# Altium schematic sheet TopLevel.SchDoc (part 2 of 3)
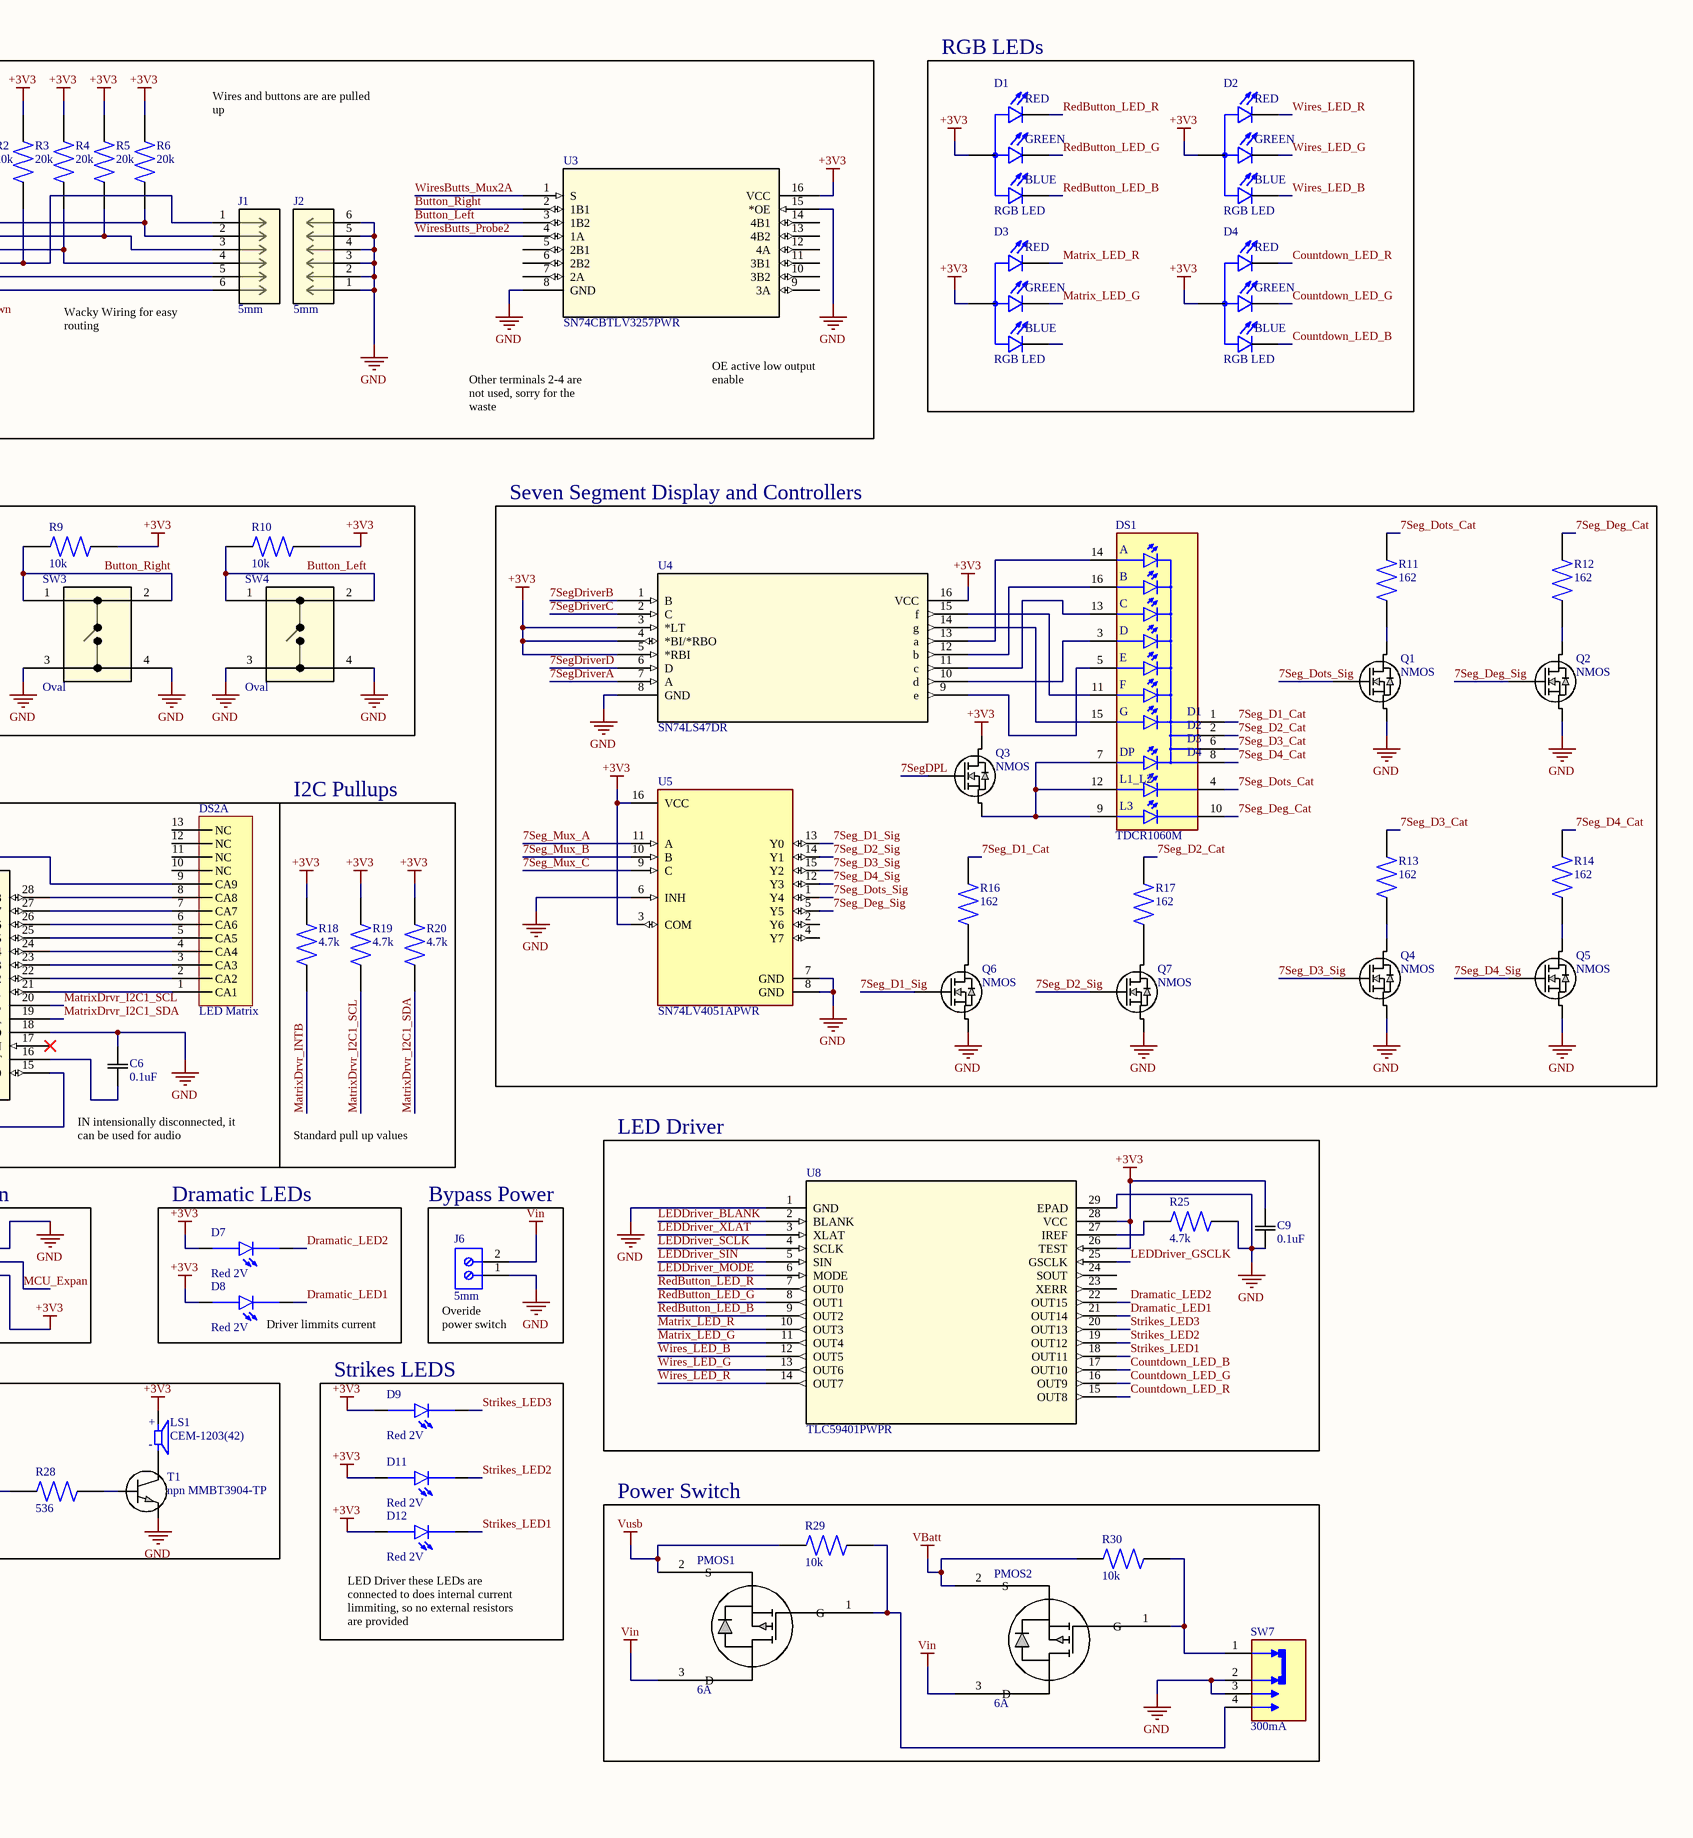
[diagram p2: TopLevel.SchDoc, right]
## Library data of the parts
C1 C3 C6 C9-C12 C15 = CAP CER 0.1uF 50V 0805: Ceramic Capacitor, Multilayer, Ceramic, 50V, 10% +Tol, 10% -Tol, X7R, 15% TC, 0.1uF, Surface Mount, 0805; Manufacturer: Yageo; Manufacturer Part Number: CC0805KRX7R9BB104; Value: 100nF; Multilayer: Yes; Supplier: Digikey; Supplier Part Number: 311-1140-1-ND; RoHS: Yes; Category: Ceramic Capacitors; Stock: 2043650; Pricing: 1=0.08, 10=0.027, 100=0.0192, 1000=0.0136 (USD); Mounting Technology: Surface Mount; Pins: 2; Dielectric Material: Ceramic; Package Shape: Rectangular; Case/Package: 0805; Terminal Finish: Nickel; Min Operating Temperature: -55°C; Max Operating Temperature: 125°C; JESD-609 Code: e3; Capacitor Type: Ceramic; Tolerance  (fill in as +-): 10%; Package Style: SMTMeter; Packaging: Tape and Reel; Tolerance (fill in as +-): 10%; Rated DC Voltage (URdc): 50V; Temperature Characteristics Code: X7R; Termination: Wraparound; Length: 2mm; Width: 1.25mm; Height: 0.85mm; Reach SVHC Compliant: Yes; RoHS Compliant: Yes; ComponentLink1URL: https://datasheet.ciiva.com:443/pdfs/VipMasterIC/IC/YAGO/YAGO-S-A0003557223/YAGO-S-A0003557223-1.pdf?src-supplier=IHS+Markit; ComponentLink1Description: https://datasheet.ciiva.com:443/pdfs/VipMasterIC/IC/YAGO/YAGO-S-A0003557223/YAGO-S-A0003557223-1.pdf?src-supplier=IHS+Markit; ComponentLink2URL: https://datasheet.ciiva.com/11786/0900766b80d84f1d-11786009.pdf?src-supplier=Rs; ComponentLink2Description: https://datasheet.ciiva.com/11786/0900766b80d84f1d-11786009.pdf?src-supplier=Rs; ComponentLink3URL: https://datasheet.ciiva.com/11464/upy-gphc-x7r-6-3v-to-50v-8-11464757.pdf?src-supplier=Avnet; ComponentLink3Description: https://datasheet.ciiva.com/11464/upy-gphc-x7r-6-3v-to-50v-8-11464757.pdf?src-supplier=Avnet; ComponentLink4URL: https://datasheet.ciiva.com/155/mlccorderingcode-155930.pdf?src-supplier=Digikey; ComponentLink4Description: https://datasheet.ciiva.com/155/mlccorderingcode-155930.pdf?src-supplier=Digikey; ComponentLink5URL: https://datasheet.ciiva.com/28450/1489800-28450805.pdf?src-supplier=Element14; ComponentLink5Description: https://datasheet.ciiva.com/28450/1489800-28450805.pdf?src-supplier=Element14; ComponentLink6URL: https://datasheet.ciiva.com/46393/1734573-46393307.pdf?src-supplier=Element14; ComponentLink6Description: https://datasheet.ciiva.com/46393/1734573-46393307.pdf?src-supplier=Element14; ComponentLink7URL: https://datasheet.ciiva.com/155/mlccorderingcode-155929.pdf?src-supplier=Digikey; ComponentLink7Description: https://datasheet.ciiva.com/155/mlccorderingcode-155929.pdf?src-supplier=Digikey; ComponentLink8URL: https://datasheet.ciiva.com/155/mlccorderingcode-155931.pdf?src-supplier=Digikey; ComponentLink8Description: https://datasheet.ciiva.com/155/mlccorderingcode-155931.pdf?src-supplier=Digikey; ComponentLink9URL: https://datasheet.ciiva.com/29242/445210-da-01-en-kerko-chip-0805-x7r-0-1uf-10proz-50vg-29242074.pdf?src-supplier=Conrad; ComponentLink9Description: https://datasheet.ciiva.com/29242/445210-da-01-en-kerko-chip-0805-x7r-0-1uf-10proz-50vg-29242074.pdf?src-supplier=Conrad
C2 C7 C14 = CAP CER 1uF 50V 0805: Ceramic Capacitor, Multilayer, Ceramic, 50V, 10% +Tol, 10% -Tol, X7R, 15% TC, 1uF, Surface Mount, 0805; Manufacturer: Samsung; Manufacturer Part Number: CL21B105KBFNNNE; Multilayer: Yes; Supplier: Digikey; Supplier Part Number: 1276-1029-1-ND; RoHS: Yes; Category: Ceramic Capacitors; Stock: 365183; Pricing: 1=0.08, 10=0.024, 100=0.016, 1000=0.01299 (USD); Mounting Technology: Surface Mount; Pins: 2; Dielectric Material: Ceramic; Package Shape: Rectangular; Case/Package: 0805; Terminal Finish: Nickel; Min Operating Temperature: -55°C; Max Operating Temperature: 125°C; JESD-609 Code: e3; Value: 1uF; Capacitor Type: Ceramic; Tolerance  (fill in as +-): 10%; Package Style: SMTMeter; Packaging: Tape and Reel; Tolerance (fill in as +-): 10%; Rated DC Voltage (URdc): 50V; Temperature Characteristics Code: X7R; Termination: Wraparound; Length: 2mm; Width: 1.25mm; Height: 1.35mm; Reach SVHC Compliant: Yes; RoHS Compliant: Yes; ComponentLink1URL: https://datasheet.ciiva.com:443/pdfs/VipMasterIC/IC/SEMS/SEMS-S-A0008524728/SEMS-S-A0008523023-1.pdf?src-supplier=IHS+Markit; ComponentLink1Description: https://datasheet.ciiva.com:443/pdfs/VipMasterIC/IC/SEMS/SEMS-S-A0008524728/SEMS-S-A0008523023-1.pdf?src-supplier=IHS+Markit; ComponentLink2URL: https://datasheet.ciiva.com/16449/cl21b105kbfnnne-16449003.pdf?src-supplier=Future+Electronics; ComponentLink2Description: https://datasheet.ciiva.com/16449/cl21b105kbfnnne-16449003.pdf?src-supplier=Future+Electronics; ComponentLink3URL: https://datasheet.ciiva.com/25800/cl21b105kbfnnne-25800291.pdf?src-supplier=Digikey; ComponentLink3Description: https://datasheet.ciiva.com/25800/cl21b105kbfnnne-25800291.pdf?src-supplier=Digikey
C4 C5 = CAP CER 24pF 5% 50V 0805: CAP CER 24PF 50V NPO 0805; Manufacturer: Yageo; Manufacturer Part Number: CC0805JRNPO9BN240; Supplier: Digikey; Supplier Part Number: 311-4231-1-ND; RoHS: Yes; Category: Ceramic Capacitors; Stock: 4936; Pricing: 1=0.12, 10=0.067, 100=0.0407, 1000=0.02693 (USD); ComponentLink1URL: https://datasheet.ciiva.com/13263/upy-gp-np0-16v-to-50v-8-3714-13263821.pdf?src-supplier=Mouser; ComponentLink1Description: https://datasheet.ciiva.com/13263/upy-gp-np0-16v-to-50v-8-3714-13263821.pdf?src-supplier=Mouser
C8 C13 = CAP CER 4.7uF 50V 0805: Ceramic Capacitor, Multilayer, Ceramic, 25V, 10% +Tol, 10% -Tol, X5R, 15% TC, 4.7uF, Surface Mount, 0805; Manufacturer: Samsung; Manufacturer Part Number: CL21A475KAQNNNE; Multilayer: Yes; Supplier: Digikey; Supplier Part Number: 1276-1244-1-ND; RoHS: Yes; Category: Ceramic Capacitors; Stock: 2361940; Pricing: 1=0.1, 10=0.057, 100=0.0337, 1000=0.02199 (USD); Mounting Technology: Surface Mount; Pins: 2; Dielectric Material: Ceramic; Package Shape: Rectangular; Case/Package: 0805; Terminal Finish: Nickel; Min Operating Temperature: -55°C; Max Operating Temperature: 85°C; JESD-609 Code: e3; Value: 4.7uF; Capacitor Type: Ceramic; Tolerance  (fill in as +-): 10%; Package Style: SMTMeter; Packaging: Tape and Reel; Tolerance (fill in as +-): 10%; Rated DC Voltage (URdc): 25V; Temperature Characteristics Code: X5R; Termination: Wraparound; Length: 2mm; Width: 1.25mm; Height: 1.4mm; Reach SVHC Compliant: Yes; RoHS Compliant: Yes; ComponentLink1URL: https://datasheet.ciiva.com:443/pdfs/VipMasterIC/IC/SEMS/SEMS-S-A0008528919/SEMS-S-A0008528938-1.pdf?src-supplier=IHS+Markit; ComponentLink1Description: https://datasheet.ciiva.com:443/pdfs/VipMasterIC/IC/SEMS/SEMS-S-A0008528919/SEMS-S-A0008528938-1.pdf?src-supplier=IHS+Markit; ComponentLink2URL: https://datasheet.ciiva.com/25798/cl21a475kaqnnne-25798882.pdf?src-supplier=Digikey; ComponentLink2Description: https://datasheet.ciiva.com/25798/cl21a475kaqnnne-25798882.pdf?src-supplier=Digikey
D1-D4 = DI LED RGB ComAnode: Visible LED; Manufacturer: Cree; Manufacturer Part Number: CLMVC-FKA-CL1D1L71BB7C3C3; Optoelectronic Device Type: TRIPLE COLOR LED; Supplier: Digikey; Supplier Part Number: CLMVC-FKA-CL1D1L71BB7C3C3CT-ND; RoHS: Yes; Category: LEDs; Stock: 54235; Pricing: 1=0.23, 10=0.212, 100=0.1961, 1000=0.175 (USD); RoHS Compliant: Yes; ComponentLink1URL: https://datasheet.ciiva.com:443/pdfs/VipMasterIC/IC/CREE/CREE-S-A0009778054/CREE-S-A0009830979-1.pdf?src-supplier=IHS+Markit; ComponentLink1Description: https://datasheet.ciiva.com:443/pdfs/VipMasterIC/IC/CREE/CREE-S-A0009778054/CREE-S-A0009830979-1.pdf?src-supplier=IHS+Markit; ComponentLink2URL: http://www.farnell.com/datasheets/2813774.pdf?src-supplier=Farnell; ComponentLink2Description: http://www.farnell.com/datasheets/2813774.pdf?src-supplier=Farnell; ComponentLink3URL: http://www.mouser.com/ds/2/90/1273-CLMVC-FKA-1064221.pdf?src-supplier=Mouser; ComponentLink3Description: http://www.mouser.com/ds/2/90/1273-CLMVC-FKA-1064221.pdf?src-supplier=Mouser; ComponentLink4URL: http://www.farnell.com/datasheets/2813774.pdf?src-supplier=Newark; ComponentLink4Description: http://www.farnell.com/datasheets/2813774.pdf?src-supplier=Newark; ComponentLink5URL: http://www.farnell.com/datasheets/2813774.pdf?src-supplier=Element14; ComponentLink5Description: http://www.farnell.com/datasheets/2813774.pdf?src-supplier=Element14; ComponentLink6URL: http://www.cree.com/led-components/media/documents/1273-CLMVC-FKA.pdf?src-supplier=Digikey; ComponentLink6Description: http://www.cree.com/led-components/media/documents/1273-CLMVC-FKA.pdf?src-supplier=Digikey; ComponentLink7URL: https://www.cree.com/led-components/media/documents/1273-CLMVC-FKA.pdf?src-supplier=Digikey; ComponentLink7Description: https://www.cree.com/led-components/media/documents/1273-CLMVC-FKA.pdf?src-supplier=Digikey
D5 D6 = Diode Schottky 25V 1A: Rectifier Diode, Schottky, 1 Phase, 1 Element, 1A, 25V V(RRM), Silicon; Manufacturer: Rohm; Manufacturer Part Number: RB161MM-20TR; Package Body Material: Plastic; Additional Feature: HIGH RELIABILITY; Forward Voltage: 320mV; Non-rep Pk Forward Current-Max: 30A; Number of Elements: 1; Supplier: Digikey; Supplier Part Number: RB161MM-20CT-ND; RoHS: Yes; Category: Schottky Diodes; Stock: 16963; Pricing: 1=0.48, 10=0.297, 100=0.1885, 500=0.14128, 1000=0.12601 (USD); Pins: 2; Diode Element Material: SILICON; Package Shape: Rectangular; Max Operating Temperature: 125°C; Diode Type: RECTIFIER; JESD-30 Code: R-PDSO-F2; Moisture Sensitivity Level: 1; Max Output current: 1A; Package Style: SMALL OUTLINEMeter; Rep Pk Reverse Voltage-Max: 25V; Surface Mount: Yes; Technology: SCHOTTKY; Terminal Form: Flat; Terminal Position: DUAL; Reach SVHC Compliant: Yes; RoHS Compliant: Yes; ComponentLink1URL: https://datasheet.ciiva.com:443/pdfs/VipMasterIC/IC/ROHM/ROHM-S-A0008264857/ROHM-S-A0008264857-1.pdf?src-supplier=IHS+Markit; ComponentLink1Description: https://datasheet.ciiva.com:443/pdfs/VipMasterIC/IC/ROHM/ROHM-S-A0008264857/ROHM-S-A0008264857-1.pdf?src-supplier=IHS+Markit; ComponentLink2URL: http://www.farnell.com/datasheets/2646198.pdf?src-supplier=Farnell; ComponentLink2Description: http://www.farnell.com/datasheets/2646198.pdf?src-supplier=Farnell; ComponentLink3URL: http://datasheet.octopart.com/RB161MM-20TR-Rohm-datasheet-138897563.pdf?src-supplier=Digikey; ComponentLink3Description: http://datasheet.octopart.com/RB161MM-20TR-Rohm-datasheet-138897563.pdf?src-supplier=Digikey; ComponentLink4URL: http://rohmfs.rohm.com/en/techdata_basic/diode/taping/Taping_PMDU(M)_TR-e.pdf?src-supplier=Digikey; ComponentLink4Description: http://rohmfs.rohm.com/en/techdata_basic/diode/taping/Taping_PMDU(M)_TR-e.pdf?src-supplier=Digikey; ComponentLink5URL: http://datasheet.octopart.com/RB161MM-20TR-Rohm-datasheet-138897563.pdf?src-supplier=Avnet; ComponentLink5Description: http://datasheet.octopart.com/RB161MM-20TR-Rohm-datasheet-138897563.pdf?src-supplier=Avnet; ComponentLink6URL: http://datasheet.octopart.com/RB161MM-20TR-Rohm-datasheet-138897563.pdf?src-supplier=Mouser; ComponentLink6Description: http://datasheet.octopart.com/RB161MM-20TR-Rohm-datasheet-138897563.pdf?src-supplier=Mouser; ComponentLink7URL: http://www.farnell.com/datasheets/2646198.pdf?src-supplier=Newark; ComponentLink7Description: http://www.farnell.com/datasheets/2646198.pdf?src-supplier=Newark; ComponentLink8URL: http://datasheet.octopart.com/RB161MM-20TR-Rohm-datasheet-138897563.pdf?src-supplier=Rs; ComponentLink8Description: http://datasheet.octopart.com/RB161MM-20TR-Rohm-datasheet-138897563.pdf?src-supplier=Rs; ComponentLink9URL: https://datasheet.octopart.com/RB161MM-20TR-Rohm-datasheet-97465509.pdf?src-supplier=Future+Electronics; ComponentLink9Description: https://datasheet.octopart.com/RB161MM-20TR-Rohm-datasheet-97465509.pdf?src-supplier=Future+Electronics; ComponentLink10URL: http://datasheet.octopart.com/RB161MM-20TR-Rohm-datasheet-138897563.pdf?src-supplier=Quest; ComponentLink10Description: http://datasheet.octopart.com/RB161MM-20TR-Rohm-datasheet-138897563.pdf?src-supplier=Quest; ComponentLink11URL: http://datasheet.octopart.com/RB161MM-20TR-Rohm-datasheet-138897563.pdf?src-supplier=TTI; ComponentLink11Description: http://datasheet.octopart.com/RB161MM-20TR-Rohm-datasheet-138897563.pdf?src-supplier=TTI
D7-D12 = DIO LED RED 2V 0805: Single Color LED, Red Orange, Water Clear, 1.4mm; Manufacturer: Vishay Lite-On; Manufacturer Part Number: LTST-C170KAKT; Color: Red,Orange; Shape: Rectangular; Forward Current: 30mA; Forward Voltage: 2.4V; Luminous Intensity-Nom: 55mcd; Channels: 1; Reverse Voltage-Max: 5V; Viewing Angle: 130°; Overall Height: 1.1mm; Supplier: Digikey; Supplier Part Number: 160-1412-1-ND; RoHS: Yes; Category: LEDs; Stock: 5192; Pricing: 1=0.22, 10=0.153, 100=0.1065, 500=0.08542, 1000=0.07842 (USD); Mounting Technology: Surface Mount; Pins: 2; Color@wavelength: Orange; Min Operating Temperature: -55°C; Max Operating Temperature: 85°C; Lens Style: WATER CLEAR; Optoelectronic Device Type: SINGLE COLOR LED; Packaging: Tape and Reel; Size: 1.4mm; Terminal Pitch: 2.1mm; Reach SVHC Compliant: Yes; RoHS Compliant: Yes; ComponentLink1URL: https://datasheet.ciiva.com:443/pdfs/VipMasterIC/IC/LITE/LITES11806/LITES11806-1.pdf?src-supplier=IHS+Markit; ComponentLink1Description: https://datasheet.ciiva.com:443/pdfs/VipMasterIC/IC/LITE/LITES11806/LITES11806-1.pdf?src-supplier=IHS+Markit; ComponentLink2URL: https://datasheet.ciiva.com/2110/ltst-c170kakt-2110491.pdf?src-supplier=Digikey; ComponentLink2Description: https://datasheet.ciiva.com/2110/ltst-c170kakt-2110491.pdf?src-supplier=Digikey; ComponentLink3URL: https://datasheet.ciiva.com/12403/ltstc170kaktliteon-201792-12403844.pdf?src-supplier=Mouser; ComponentLink3Description: https://datasheet.ciiva.com/12403/ltstc170kaktliteon-201792-12403844.pdf?src-supplier=Mouser; ComponentLink4URL: https://datasheet.ciiva.com/2110/s-110-ltst-c170kakt-2110492.pdf?src-supplier=Digikey; ComponentLink4Description: https://datasheet.ciiva.com/2110/s-110-ltst-c170kakt-2110492.pdf?src-supplier=Digikey; ComponentLink5URL: https://datasheet.ciiva.com/2110/s-110-ltst-c170kakt-2110493.pdf?src-supplier=Digikey; ComponentLink5Description: https://datasheet.ciiva.com/2110/s-110-ltst-c170kakt-2110493.pdf?src-supplier=Digikey
DS1 = DISP 7-seg 4Char Clock: Clock LED Display, 4-Character, Red, 10mm; Manufacturer: Vishay; Forward Current: 25mA; Forward Voltage: 2.4V; Number of Characters: 4; Supplier: Digikey; Supplier Part Number: TDCR1060M-ND; Manufacturer Part Number: TDCR1060M; RoHS: Yes; Category: Optoelectronics; Stock: 3748; Pricing: 1=3.34, 12=2.39083, 108=1.8975, 504=1.67593, 1008=1.59991, 2004=1.53608, 5004=1.46597 (USD); Color: Red; Color@wavelength: Red; Min Operating Temperature: -40°C; Max Operating Temperature: 85°C; Display Height: 10mm; Channels: 4; Optoelectronic Device Type: CLOCK LED DISPLAY; RoHS Compliant: Yes; ComponentLink1URL: https://datasheet.ciiva.com:443/pdfs/VipMasterIC/IC/VISH/VISH-S-A0003301798/VISH-S-A0004391181-1.pdf?src-supplier=IHS+Markit; ComponentLink1Description: https://datasheet.ciiva.com:443/pdfs/VipMasterIC/IC/VISH/VISH-S-A0003301798/VISH-S-A0004391181-1.pdf?src-supplier=IHS+Markit; ComponentLink2URL: https://datasheet.ciiva.com/18549/tdc10m-18549753.pdf?src-supplier=Digikey; ComponentLink2Description: https://datasheet.ciiva.com/18549/tdc10m-18549753.pdf?src-supplier=Digikey
DS2 = LEDARR 2973 9X16
J1 J2 = CONN SCREW 6pos 45Deg 5mm: Barrier Strip Terminal Block, 17.5A, 2.5mm2, 1 Row(s), 1 Deck(s); Manufacturer: Phoenix Contact; Manufacturer Part Number: 1988846; Fastening Method: SCREW; Number of Decks: 1; Number of Ways: 6; Voltage Rating: 250V; Wire/Cable Gauge: 14AWG; Safety Approval: UL; Supplier: Digikey; Supplier Part Number: 277-1768-ND; RoHS: Yes; Category: Terminal Blocks; Stock: 343; Pricing: 1=1.88, 10=1.345, 25=1.246, 50=1.2338 (USD); Mounting Technology: Board; Manufacturer Series: 1988846; Number of Rows: 1; Current Rating: 17.5A; Terminal and Terminal Block Type: BARRIER STRIP TERMINAL BLOCK; Wire Cross Section: 2.5mm2; RoHS Compliant: Yes; Reach SVHC Compliant: No; ComponentLink1URL: https://datasheet.ciiva.com:443/pdfs/VipMasterIC/IC/PCON/PCONS10841/PCONS10841-1.pdf?src-supplier=IHS+Markit; ComponentLink1Description: https://datasheet.ciiva.com:443/pdfs/VipMasterIC/IC/PCON/PCONS10841/PCONS10841-1.pdf?src-supplier=IHS+Markit; ComponentLink2URL: https://datasheet.ciiva.com/16051/1988846-16051352.pdf?src-supplier=Onlinecomponents.com; ComponentLink2Description: https://datasheet.ciiva.com/16051/1988846-16051352.pdf?src-supplier=Onlinecomponents.com; ComponentLink3URL: https://datasheet.ciiva.com/14820/1988846-14820464.pdf?src-supplier=Arrow+Electronics; ComponentLink3Description: https://datasheet.ciiva.com/14820/1988846-14820464.pdf?src-supplier=Arrow+Electronics; ComponentLink4URL: https://datasheet.ciiva.com/26340/567909-da-01-nl-printklem-1988846-100-st-26340596.pdf?src-supplier=Conrad; ComponentLink4Description: https://datasheet.ciiva.com/26340/567909-da-01-nl-printklem-1988846-100-st-26340596.pdf?src-supplier=Conrad; ComponentLink5URL: https://datasheet.ciiva.com/14610/70055186-14610565.pdf?src-supplier=Allied+Electronics; ComponentLink5Description: https://datasheet.ciiva.com/14610/70055186-14610565.pdf?src-supplier=Allied+Electronics; ComponentLink6URL: https://datasheet.ciiva.com/823/combiconcompact5-0mmseries-823782.pdf?src-supplier=Digikey; ComponentLink6Description: https://datasheet.ciiva.com/823/combiconcompact5-0mmseries-823782.pdf?src-supplier=Digikey
J3 J4 J6 = CON Screw 2Pos 5.00mm: Barrier Strip Terminal Block; Manufacturer: Wurth Electronics; Manufacturer Part Number: 691137710002; Supplier: Digikey; Supplier Part Number: 732-10955-ND; RoHS: No; Category: Terminal Blocks; Stock: 25735; Pricing: 1=0.36, 10=0.327, 50=0.288, 100=0.2583, 500=0.2493 (USD); RoHS Compliant: Yes; ComponentLink1URL: https://datasheet.ciiva.com:443/pdfs/VipMasterIC/IC/MIDC/MIDC-S-A0005074262/MIDC-S-A0004711666-1.pdf?src-supplier=IHS+Markit; ComponentLink1Description: https://datasheet.ciiva.com:443/pdfs/VipMasterIC/IC/MIDC/MIDC-S-A0005074262/MIDC-S-A0004711666-1.pdf?src-supplier=IHS+Markit; ComponentLink2URL: https://katalog.we-online.de/em/datasheet/691137710002.pdf?src-supplier=Digikey; ComponentLink2Description: https://katalog.we-online.de/em/datasheet/691137710002.pdf?src-supplier=Digikey
J5 = CONN SCREW 3pos 5.0mm: Barrier Strip Terminal Block, 17.5A, 1.5mm2, 1 Row(s), 1 Deck(s); Manufacturer: Phoenix Contact; Manufacturer Part Number: 1935174; Fastening Method: SCREW; Number of Decks: 1; Number of Ways: 3; Voltage Rating: 250V; Wire/Cable Gauge: 14AWG; Safety Approval: UL; Supplier: Digikey; Supplier Part Number: 277-1578-ND; RoHS: Yes; Category: Terminal Blocks; Stock: 18353; Pricing: 1=1.04, 10=0.748, 25=0.6516, 50=0.5892, 100=0.5688 (USD); Mounting Technology: Board; Manufacturer Series: 1935174; Number of Rows: 1; Current Rating: 17.5A; Terminal and Terminal Block Type: BARRIER STRIP TERMINAL BLOCK; Wire Cross Section: 1.5mm2; RoHS Compliant: Yes; Reach SVHC Compliant: No; ComponentLink1URL: https://datasheet.ciiva.com:443/pdfs/VipMasterIC/IC/PCON/PCON-S-A0007661889/PCON-S-A0008047997-1.pdf?src-supplier=IHS+Markit; ComponentLink1Description: https://datasheet.ciiva.com:443/pdfs/VipMasterIC/IC/PCON/PCON-S-A0007661889/PCON-S-A0008047997-1.pdf?src-supplier=IHS+Markit; ComponentLink2URL: https://datasheet.ciiva.com/16047/1935174-16047249.pdf?src-supplier=Onlinecomponents.com; ComponentLink2Description: https://datasheet.ciiva.com/16047/1935174-16047249.pdf?src-supplier=Onlinecomponents.com; ComponentLink3URL: https://datasheet.ciiva.com/15169/getdatasheetpartid-212213-15169949.pdf?src-supplier=Verical; ComponentLink3Description: https://datasheet.ciiva.com/15169/getdatasheetpartid-212213-15169949.pdf?src-supplier=Verical; ComponentLink4URL: https://datasheet.ciiva.com/823/combiconcompact5-0mmseries-823761.pdf?src-supplier=Digikey; ComponentLink4Description: https://datasheet.ciiva.com/823/combiconcompact5-0mmseries-823761.pdf?src-supplier=Digikey; ComponentLink5URL: https://datasheet.ciiva.com/29218/744167-da-01-en-printklemme-pt-1-5-3-5-0-h-29218252.pdf?src-supplier=Conrad; ComponentLink5Description: https://datasheet.ciiva.com/29218/744167-da-01-en-printklemme-pt-1-5-3-5-0-h-29218252.pdf?src-supplier=Conrad
J7 = CON USB micro ab: USB Connector, 5 Contact(s), Female, Right Angle, Surface Mount Terminal, Locking, Receptacle; Manufacturer: Molex; Manufacturer Part Number: 47590-0001; Connector Type: TELECOM AND DATACOM CONNECTOR; Option: General Purpose; Additional Feature: Shielded; Board Mounting Option: PEG; Contact Resistance: 30mR; Dielectric Withstanding Voltage (AC): 141V; Durability: 10000Cycles; Empty Shell: No; Insulation Resistance: 1GR; Number Of Connectors: 1; PCB Contact Pattern: RECTANGULAR; Polarization Key: POLAR PIN POSITION; Rated Current (Signal): 1A; Number of Contacts: 5; Body Breadth: 0.118inch; Body Depth: 0.232inch; Body Length: 0.295inch; Reference Standard: UL; Reliability: COMMERCIAL; Supplier: Digikey; Supplier Part Number: WM17144CT-ND; RoHS: Yes; Category: USB Connectors; Stock: 37888; Pricing: 1=0.75, 10=0.636, 25=0.5964, 50=0.568, 100=0.5408, 250=0.50688, 500=0.48264 (USD); Mounting Technology: Cable; Contact Material: Copper Alloy; Contact Finish - Mating: GOLD; Contact Finish - Termination: Gold (Au); Insulation Material: Polymer; Shell Finish: Tin; Shell Material: Stainless Steel; Min Operating Temperature: -30°C; Max Operating Temperature: 85°C; JESD-609 Code: e4; Body/Shell Style: RECEPTACLE; Contact Gender: Female; Filter Feature: No; Mixed Contacts: No; Mounting Style: RIGHT ANGLE; Number Of PCB Rows: 1; Termination: SMD/SMT; Mounting Option 1: LOCKING; Terminal Pitch: 0.6604mm; Reach SVHC Compliant: Yes; RoHS Compliant: Yes; DIN Conformance: No; IEC Conformance: No; MIL Conformance: No; ComponentLink1URL: https://datasheet.ciiva.com:443/pdfs/VipMasterIC/IC/MOLE/MOLE-S-A0000442751/MOLE-S-A0000443003-1.pdf?src-supplier=IHS+Markit; ComponentLink1Description: https://datasheet.ciiva.com:443/pdfs/VipMasterIC/IC/MOLE/MOLE-S-A0000442751/MOLE-S-A0000443003-1.pdf?src-supplier=IHS+Markit; ComponentLink2URL: https://datasheet.ciiva.com/11731/0900766b80dfe0a6-11731294.pdf?src-supplier=Rs; ComponentLink2Description: https://datasheet.ciiva.com/11731/0900766b80dfe0a6-11731294.pdf?src-supplier=Rs; ComponentLink3URL: https://datasheet.ciiva.com/1098/1597781-1098479.pdf?src-supplier=Element14; ComponentLink3Description: https://datasheet.ciiva.com/1098/1597781-1098479.pdf?src-supplier=Element14; ComponentLink4URL: https://datasheet.ciiva.com/16148/0475900001-io-connectors-16148922.pdf?src-supplier=Onlinecomponents.com; ComponentLink4Description: https://datasheet.ciiva.com/16148/0475900001-io-connectors-16148922.pdf?src-supplier=Onlinecomponents.com
J8 = Con 10pos 2row Header 1.27mm Surface: Power Field-Effect Transistor, 6A I(D), 30V, 0.042ohm, 1-Element, P-Channel, Silicon, Metal-oxide Semiconductor FET; Manufacturer: Toshiba; Manufacturer Part Number: SSM3J372R,LF; Supplier: Digikey; Supplier Part Number: SSM3J372RLFCT-ND; RoHS: No; Category: LDO; Stock: 78536; Pricing: 1=0.35, 10=0.212, 100=0.1187, 500=0.09766, 1000=0.09135 (USD)
LS1 = LS Buzzer CEM-1203(42): Audio Signaling/Alarm Devices; Manufacturer: Same Sky; Supplier: Digikey; Supplier Part Number: 102-1153-ND; Manufacturer Part Number: CEM-1203(42); RoHS: Yes; Category: Buzzers; Stock: 15952; Pricing: 1=0.66, 10=0.538, 25=0.4956, 50=0.4658, 100=0.438, 250=0.40372, 500=0.37968, 1000=0.3588 (USD); ComponentLink1URL: https://www.cuidevices.com/product/resource/digikeypdf/cem-1203-42-.pdf?src-supplier=Digikey; ComponentLink1Description: https://www.cuidevices.com/product/resource/digikeypdf/cem-1203-42-.pdf?src-supplier=Digikey; ComponentLink2URL: https://datasheet.octopart.com/CEM-1203%2842%29-CUI-Devices-datasheet-175926661.pdf?src-supplier=Future+Electronics; ComponentLink2Description: https://datasheet.octopart.com/CEM-1203%2842%29-CUI-Devices-datasheet-175926661.pdf?src-supplier=Future+Electronics; ComponentLink3URL: https://datasheet.octopart.com/CEM-1203%2842%29-Same-Sky-datasheet-184673004.pdf?src-supplier=Electro+Sonic; ComponentLink3Description: https://datasheet.octopart.com/CEM-1203%2842%29-Same-Sky-datasheet-184673004.pdf?src-supplier=Electro+Sonic; ComponentLink4URL: https://datasheet.octopart.com/CEM-1203%2842%29-CUI-Devices-datasheet-175925305.pdf?src-supplier=Master+Electronics; ComponentLink4Description: https://datasheet.octopart.com/CEM-1203%2842%29-CUI-Devices-datasheet-175925305.pdf?src-supplier=Master+Electronics
PMOS1 PMOS2 = MOS PMOS 30V 6A: Power Field-Effect Transistor, 6A I(D), 30V, 0.042ohm, 1-Element, P-Channel, Silicon, Metal-oxide Semiconductor FET; Manufacturer: Toshiba; Manufacturer Part Number: SSM3J372R,LF; Supplier: Digikey; Supplier Part Number: SSM3J372RLFCT-ND; RoHS: No; Category: LDO; Stock: 64640; Pricing: 1=0.35, 10=0.217, 100=0.1361, 500=0.10106, 1000=0.08971 (USD)
Q1-Q7 = MOS NMOS 20V 1A SOT323: Small Signal Field-Effect Transistor, 1A I(D), 20V, 1-Element, N-Channel, Silicon, Metal-oxide Semiconductor FET; Manufacturer: Diodes Zetex; Manufacturer Part Number: DMG1012UW-7; Package Body Material: Plastic; Time @ Peak Reflow Temperature-Max (s): 40s; Additional Feature: HIGH RELIABILITY; Drain-source On Resistance-Max: 450mR; Number of Elements: 1; Operating Mode: ENHANCEMENT MODE; Power Dissipation-Max (Abs): 290mW; Transistor Application: SWITCHING; Reference Standard: AEC-Q101; Qualification Status: Not Qualified; Supplier: Digikey; Supplier Part Number: DMG1012UW-7DICT-ND; RoHS: Yes; Category: MOSFETs; Stock: 318650; Pricing: 1=0.28, 10=0.143, 100=0.0714, 500=0.06828 (USD); Pins: 3; Package Shape: Rectangular; Terminal Finish: Tin; Transistor Element Material: SILICON; Max Operating Temperature: 150°C; JESD-609 Code: e3; JESD-30 Code: R-PDSO-G3; Moisture Sensitivity Level: 1; Package Style: SMALL OUTLINEMeter; Peak Reflow Temperature (Cel): 260°C; Surface Mount: Yes; Terminal Form: Gull Wing; Terminal Position: DUAL; Polarity/Channel Type: N-CHANNEL; Drain Current-Max (Abs) (ID): 1A; Drain Current-Max (ID): 1A; DS Breakdown Voltage-Min: 20V; FET Technology: METAL-OXIDE SEMICONDUCTOR; Reach SVHC Compliant: Yes; RoHS Compliant: Yes; ComponentLink1URL: https://datasheet.ciiva.com:443/pdfs/VipMasterIC/IC/DIOD/DIOD-S-A0009689761/DIOD-S-A0009691185-1.pdf?src-supplier=IHS+Markit; ComponentLink1Description: https://datasheet.ciiva.com:443/pdfs/VipMasterIC/IC/DIOD/DIOD-S-A0009689761/DIOD-S-A0009691185-1.pdf?src-supplier=IHS+Markit; ComponentLink2URL: https://datasheet.ciiva.com/11174/ds31859-11174966.pdf?src-supplier=Avnet; ComponentLink2Description: https://datasheet.ciiva.com/11174/ds31859-11174966.pdf?src-supplier=Avnet; ComponentLink3URL: https://datasheet.ciiva.com/4443/ds31859-90313-4443117.pdf?src-supplier=Mouser; ComponentLink3Description: https://datasheet.ciiva.com/4443/ds31859-90313-4443117.pdf?src-supplier=Mouser; ComponentLink4URL: https://datasheet.ciiva.com/6383/ds31859-6383798.pdf?src-supplier=Digikey; ComponentLink4Description: https://datasheet.ciiva.com/6383/ds31859-6383798.pdf?src-supplier=Digikey; ComponentLink5URL: https://datasheet.ciiva.com/6383/ds31859-6383800.pdf?src-supplier=Digikey; ComponentLink5Description: https://datasheet.ciiva.com/6383/ds31859-6383800.pdf?src-supplier=Digikey
R1-R6 R22-R24 = RES 20K 0.1% 0.125W 0805: Fixed Resistor, Thin Film, 0.125W, 20000ohm, 150V, 0.1% +/-Tol, 25ppm/Cel, Surface Mount, 0805; Manufacturer: Susumu; Manufacturer Part Number: RG2012P-203-B-T5; Additional Feature: ANTI-SULFUR, PRECISION; Power: 250mW; Rated Temperature: 70°C; Value: 20kR; Temperature Coefficient (ppm/Cel): 25; Package Height: 0.4mm; Package Length: 2mm; Package Width: 1.25mm; Reference Standard: AEC-Q200; Supplier: Digikey; Supplier Part Number: RG20P20.0KBCT-ND; RoHS: Yes; Category: Chip SMD Resistors; Stock: 60124; Pricing: 1=0.1, 10=0.1, 50=0.0976, 100=0.0922, 500=0.07576, 1000=0.06825 (USD); Mounting Technology: Surface Mount; Pins: 2; Case/Package: 0805; Terminal Finish: Nickel; Min Operating Temperature: -55°C; Max Operating Temperature: 155°C; Tolerance: 0.1%; JESD-609 Code: e3; Resistor Type: FIXED RESISTOR; Construction: Rectangular; Packaging: Tape and Reel; Technology: THIN FILM; Termination: Wraparound; Working Voltage: 150V; Reach SVHC Compliant: Yes; RoHS Compliant: Yes; ComponentLink1URL: https://datasheet.ciiva.com:443/pdfs/VipMasterIC/IC/SUSU/SUSU-S-A0004582566/SUSU-S-A0004582566-1.pdf?src-supplier=IHS+Markit; ComponentLink1Description: https://datasheet.ciiva.com:443/pdfs/VipMasterIC/IC/SUSU/SUSU-S-A0004582566/SUSU-S-A0004582566-1.pdf?src-supplier=IHS+Markit; ComponentLink2URL: https://datasheet.ciiva.com/2488/rg-data-sheet-2488618.pdf?src-supplier=Digikey; ComponentLink2Description: https://datasheet.ciiva.com/2488/rg-data-sheet-2488618.pdf?src-supplier=Digikey; ComponentLink3URL: https://datasheet.ciiva.com/2488/rg-data-sheet-2488619.pdf?src-supplier=Digikey; ComponentLink3Description: https://datasheet.ciiva.com/2488/rg-data-sheet-2488619.pdf?src-supplier=Digikey; ComponentLink4URL: https://datasheet.ciiva.com/2488/rg-data-sheet-2488620.pdf?src-supplier=Digikey; ComponentLink4Description: https://datasheet.ciiva.com/2488/rg-data-sheet-2488620.pdf?src-supplier=Digikey; ComponentLink5URL: https://datasheet.ciiva.com/5624/rg-rm-rgh-datasheet-5624652.pdf?src-supplier=Mouser; ComponentLink5Description: https://datasheet.ciiva.com/5624/rg-rm-rgh-datasheet-5624652.pdf?src-supplier=Mouser; ComponentLink6URL: https://datasheet.ciiva.com/17424/rg-rm-rgh-datasheet-17424937.pdf?src-supplier=Future+Electronics; ComponentLink6Description: https://datasheet.ciiva.com/17424/rg-rm-rgh-datasheet-17424937.pdf?src-supplier=Future+Electronics
R7-R10 R15 R21 R27 R29-R31 = RES 10k 5% 0.125W 0805: Fixed Resistor, Metal Glaze/thick Film, 0.125W, 10000ohm, 150V, 5% +/-Tol, 200ppm/Cel, Surface Mount, 0805; Manufacturer: Panasonic; Manufacturer Part Number: ERJ-6GEYJ103V; Power: 125mW; Rated Temperature: 70°C; Value: 10kR; Temperature Coefficient (ppm/Cel): 200; Package Height: 0.6mm; Package Length: 2mm; Package Width: 1.25mm; Reference Standard: AEC-Q200; Supplier: Digikey; Supplier Part Number: P10KACT-ND; RoHS: Yes; Category: Chip SMD Resistors; Stock: 572653; Pricing: 1=0.1, 10=0.041, 50=0.0256, 100=0.0212, 500=0.01448, 1000=0.01254 (USD); Mounting Technology: Surface Mount; Pins: 2; Package Shape: Rectangular; Case/Package: 0805; Terminal Finish: Nickel; Min Operating Temperature: -55°C; Max Operating Temperature: 155°C; Tolerance: 5%; JESD-609 Code: e3; Resistor Type: FIXED RESISTOR; Construction: Rectangular; Packaging: Tape and Reel; Technology: METAL GLAZE/THICK FILM; Termination: Wraparound; Working Voltage: 150V; Reach SVHC Compliant: Yes; RoHS Compliant: Yes; ComponentLink1URL: https://datasheet.ciiva.com:443/pdfs/VipMasterIC/IC/PANA/PANA-S-A0009891627/PANA-S-A0009891627-1.pdf?src-supplier=IHS+Markit; ComponentLink1Description: https://datasheet.ciiva.com:443/pdfs/VipMasterIC/IC/PANA/PANA-S-A0009891627/PANA-S-A0009891627-1.pdf?src-supplier=IHS+Markit; ComponentLink2URL: https://datasheet.ciiva.com/11821/0900766b80f806dd-11821504.pdf?src-supplier=Rs; ComponentLink2Description: https://datasheet.ciiva.com/11821/0900766b80f806dd-11821504.pdf?src-supplier=Rs; ComponentLink3URL: https://datasheet.ciiva.com/43460/1500035-43460125.pdf?src-supplier=Farnell; ComponentLink3Description: https://datasheet.ciiva.com/43460/1500035-43460125.pdf?src-supplier=Farnell; ComponentLink4URL: https://datasheet.ciiva.com/16787/70255313-16787775.pdf?src-supplier=Allied+Electronics; ComponentLink4Description: https://datasheet.ciiva.com/16787/70255313-16787775.pdf?src-supplier=Allied+Electronics; ComponentLink5URL: https://datasheet.ciiva.com/9117/aoa0000ce1-9117371.pdf?src-supplier=Avnet; ComponentLink5Description: https://datasheet.ciiva.com/9117/aoa0000ce1-9117371.pdf?src-supplier=Avnet; ComponentLink6URL: https://datasheet.ciiva.com/22785/1500035-22785957.pdf?src-supplier=Farnell; ComponentLink6Description: https://datasheet.ciiva.com/22785/1500035-22785957.pdf?src-supplier=Farnell; ComponentLink7URL: https://datasheet.ciiva.com/28514/1678796-28514236.pdf?src-supplier=Element14; ComponentLink7Description: https://datasheet.ciiva.com/28514/1678796-28514236.pdf?src-supplier=Element14; ComponentLink8URL: https://datasheet.ciiva.com/16782/70255313-16782712.pdf?src-supplier=Allied+Electronics; ComponentLink8Description: https://datasheet.ciiva.com/16782/70255313-16782712.pdf?src-supplier=Allied+Electronics; ComponentLink9URL: https://datasheet.ciiva.com/16428/aoa0000ce1-16428072.pdf?src-supplier=Future+Electronics; ComponentLink9Description: https://datasheet.ciiva.com/16428/aoa0000ce1-16428072.pdf?src-supplier=Future+Electronics; ComponentLink10URL: https://datasheet.ciiva.com/30128/4aoa0000ce1-30128839.pdf?src-supplier=Onlinecomponents.com; ComponentLink10Description: https://datasheet.ciiva.com/30128/4aoa0000ce1-30128839.pdf?src-supplier=Onlinecomponents.com; ComponentLink11URL: https://datasheet.ciiva.com/46386/1500035-46386469.pdf?src-supplier=Element14; ComponentLink11Description: https://datasheet.ciiva.com/46386/1500035-46386469.pdf?src-supplier=Element14
R11-R14 R16 R17 = RES 162 1% 0.125W 0805: Fixed Resistor, Metal Glaze/thick Film, 0.125W, 162ohm, 150V, 1% +/-Tol, 100ppm/Cel, Surface Mount, 0805; Manufacturer: Yageo; Manufacturer Part Number: RC0805FR-07162RL; Additional Feature: LASER TRIMMABLE; Power: 125mW; Rated Temperature: 70°C; Value: 162R; Temperature Coefficient (ppm/Cel): 100; Package Height: 0.5mm; Package Length: 2mm; Package Width: 1.25mm; Supplier: Digikey; Supplier Part Number: 311-162CRCT-ND; RoHS: Yes; Category: Chip SMD Resistors; Stock: 65718; Pricing: 1=0.1, 10=0.013, 100=0.0112, 1000=0.00816, 2500=0.00735 (USD); Mounting Technology: Surface Mount; Pins: 2; Package Shape: Rectangular; Case/Package: 0805; Terminal Finish: Nickel; Min Operating Temperature: -55°C; Max Operating Temperature: 155°C; Tolerance: 1%; JESD-609 Code: e3; Resistor Type: FIXED RESISTOR; Construction: Chip; Packaging: Tape and Reel; Technology: METAL GLAZE/THICK FILM; Termination: Wraparound; Working Voltage: 150V; Reach SVHC Compliant: Yes; RoHS Compliant: Yes; ComponentLink1URL: https://datasheet.ciiva.com:443/pdfs/VipMasterIC/IC/YAGO/YAGO-S-A0008145938/YAGO-S-A0008145938-1.pdf?src-supplier=IHS+Markit; ComponentLink1Description: https://datasheet.ciiva.com:443/pdfs/VipMasterIC/IC/YAGO/YAGO-S-A0008145938/YAGO-S-A0008145938-1.pdf?src-supplier=IHS+Markit; ComponentLink2URL: https://datasheet.ciiva.com/2457/pyu-r-int-thick-7-2457830.pdf?src-supplier=Digikey; ComponentLink2Description: https://datasheet.ciiva.com/2457/pyu-r-int-thick-7-2457830.pdf?src-supplier=Digikey; ComponentLink3URL: https://datasheet.ciiva.com/2457/pyu-r-int-thick-7-2457831.pdf?src-supplier=Digikey; ComponentLink3Description: https://datasheet.ciiva.com/2457/pyu-r-int-thick-7-2457831.pdf?src-supplier=Digikey; ComponentLink4URL: https://datasheet.ciiva.com/2457/pyu-r-int-thick-7-2457832.pdf?src-supplier=Digikey; ComponentLink4Description: https://datasheet.ciiva.com/2457/pyu-r-int-thick-7-2457832.pdf?src-supplier=Digikey
R18-R20 R25 = RES 4.7k 1% 0.125W 0805: Fixed Resistor, Metal Glaze/thick Film, 0.125W, 4700ohm, 150V, 1% +/-Tol, 100ppm/Cel, Surface Mount, 0805; Manufacturer: Vishay; Manufacturer Part Number: CRCW08054K70FKEA; Power: 125mW; Rated Temperature: 70°C; Value: 4.7kR; Temperature Coefficient (ppm/Cel): 100; Package Height: 0.45mm; Package Length: 2mm; Package Width: 1.25mm; Reference Standard: AEC-Q200; Supplier: Digikey; Supplier Part Number: 541-4.70KCCT-ND; RoHS: Yes; Category: Chip SMD Resistors; Stock: 228783; Pricing: 1=0.1, 10=0.041, 100=0.0212, 1000=0.01387 (USD); Mounting Technology: Surface Mount; Pins: 2; Package Shape: Rectangular; Case/Package: 0805; Terminal Finish: Nickel; Min Operating Temperature: -55°C; Max Operating Temperature: 155°C; Tolerance: 1%; JESD-609 Code: e3; Resistor Type: FIXED RESISTOR; Construction: Chip; Packaging: Tape and Reel; Technology: METAL GLAZE/THICK FILM; Termination: Wraparound; Working Voltage: 150V; Reach SVHC Compliant: Yes; RoHS Compliant: Yes; ComponentLink1URL: https://datasheet.ciiva.com:443/pdfs/VipMasterIC/IC/VISH/VISH-S-A0007266705/VISH-S-A0007266705-1.pdf?src-supplier=IHS+Markit; ComponentLink1Description: https://datasheet.ciiva.com:443/pdfs/VipMasterIC/IC/VISH/VISH-S-A0007266705/VISH-S-A0007266705-1.pdf?src-supplier=IHS+Markit; ComponentLink2URL: https://datasheet.ciiva.com/26317/fld-crcw-e3-data-en-26317145.pdf?src-supplier=Distrelec; ComponentLink2Description: https://datasheet.ciiva.com/26317/fld-crcw-e3-data-en-26317145.pdf?src-supplier=Distrelec; ComponentLink3URL: https://datasheet.ciiva.com/2467/dcrcwe3-2467438.pdf?src-supplier=Digikey; ComponentLink3Description: https://datasheet.ciiva.com/2467/dcrcwe3-2467438.pdf?src-supplier=Digikey; ComponentLink4URL: https://datasheet.ciiva.com/16213/dcrcwe3-16213733.pdf?src-supplier=Future+Electronics; ComponentLink4Description: https://datasheet.ciiva.com/16213/dcrcwe3-16213733.pdf?src-supplier=Future+Electronics
R26 R28 = RES 536 1% 0.125W 0805: Fixed Resistor, Metal Glaze/thick Film, 0.125W, 536ohm, 150V, 1% +/-Tol, 100ppm/Cel, Surface Mount, 0805; Manufacturer: Yageo; Manufacturer Part Number: RC0805FR-07536RL; Additional Feature: LASER TRIMMABLE; Power: 125mW; Rated Temperature: 70°C; Value: 536R; Temperature Coefficient (ppm/Cel): 100; Package Height: 0.5mm; Package Length: 2mm; Package Width: 1.25mm; Supplier: Digikey; Supplier Part Number: 311-536CRCT-ND; RoHS: Yes; Category: Chip SMD Resistors; Stock: 234523; Pricing: 1=0.1, 10=0.013, 100=0.0122, 1000=0.00714, 2500=0.00686 (USD); Mounting Technology: Surface Mount; Pins: 2; Package Shape: Rectangular; Case/Package: 0805; Terminal Finish: Nickel; Min Operating Temperature: -55°C; Max Operating Temperature: 155°C; Tolerance: 1%; JESD-609 Code: e3; Resistor Type: FIXED RESISTOR; Construction: Chip; Packaging: Tape and Reel; Technology: METAL GLAZE/THICK FILM; Termination: Wraparound; Working Voltage: 150V; Reach SVHC Compliant: Yes; RoHS Compliant: Yes; ComponentLink1URL: https://datasheet.ciiva.com:443/pdfs/VipMasterIC/IC/YAGO/YAGO-S-A0008145938/YAGO-S-A0008145938-1.pdf?src-supplier=IHS+Markit; ComponentLink1Description: https://datasheet.ciiva.com:443/pdfs/VipMasterIC/IC/YAGO/YAGO-S-A0008145938/YAGO-S-A0008145938-1.pdf?src-supplier=IHS+Markit; ComponentLink2URL: https://datasheet.ciiva.com/17086/rc0805-17086270.pdf?src-supplier=Future+Electronics; ComponentLink2Description: https://datasheet.ciiva.com/17086/rc0805-17086270.pdf?src-supplier=Future+Electronics
SW1-SW4 = SW Off-Mom OvalPush: Keypad Switch, 1 Switches, SPST, Momentary-tactile, 0.05A, 12VDC, 1.76N, Solder Terminal, Surface Mount-straight; Manufacturer: E-Switch; Manufacturer Part Number: TL3365AF180QG; Supplier: Digikey; Supplier Part Number: EG5384CT-ND; RoHS: No; Category: Tactile Switches; Stock: 5947; Pricing: 1=0.24, 10=0.211, 25=0.198, 100=0.1776, 250=0.16468, 500=0.1554, 1000=0.14667 (USD); RoHS Compliant: Yes; ComponentLink1URL: https://datasheet.ciiva.com:443/pdfs/VipMasterIC/IC/ESCH/ESCH-S-A0007025580/ESCH-S-A0007025580-1.pdf?src-supplier=IHS+Markit; ComponentLink1Description: https://datasheet.ciiva.com:443/pdfs/VipMasterIC/IC/ESCH/ESCH-S-A0007025580/ESCH-S-A0007025580-1.pdf?src-supplier=IHS+Markit; ComponentLink2URL: http://www.farnell.com/datasheets/2628629.pdf?src-supplier=Farnell; ComponentLink2Description: http://www.farnell.com/datasheets/2628629.pdf?src-supplier=Farnell; ComponentLink3URL: http://www.farnell.com/datasheets/2628629.pdf?src-supplier=Newark; ComponentLink3Description: http://www.farnell.com/datasheets/2628629.pdf?src-supplier=Newark; ComponentLink4URL: https://www.e-switch.com/system/asset/product_line/data_sheet/218/TL3365.pdf?src-supplier=Digikey; ComponentLink4Description: https://www.e-switch.com/system/asset/product_line/data_sheet/218/TL3365.pdf?src-supplier=Digikey; ComponentLink5URL: http://www.farnell.com/datasheets/2628629.pdf?src-supplier=Element14; ComponentLink5Description: http://www.farnell.com/datasheets/2628629.pdf?src-supplier=Element14; ComponentLink6URL: https://datasheet.octopart.com/TL3365AF180QG-E-Switch-datasheet-188936971.pdf?src-supplier=TME; ComponentLink6Description: https://datasheet.octopart.com/TL3365AF180QG-E-Switch-datasheet-188936971.pdf?src-supplier=TME
SW5 = SW 2pos Through RightAngle: Slide Switch, 2 Positions, SPDT, On-on, Latched, 0.1A, 12VDC, 5 PCB Hole Cnt, Solder Terminal, Through Hole-right Angle; Manufacturer: ITT C&K; Manufacturer Part Number: OS102011MA1QN1C; Manufacturer Series: OS; Actuator Material: Polyoxymethylene; Actuator Color: Black; Center Contact Plating: Silver; End Contact Material: Copper Alloy; Contact Current(DC)-Max: 100mA; Contact DC Max Rating R Load: .1A@12VDC; Contact Voltage(DC)-Max: 12V; Contact Resistance: 0.02mR; Dielectric Withstand Volts: 500VACV; Insulation Resistance: 100MR; Number of Positions: 2; PCB Hole Count: 5; Body Breadth: 4.4mm; Body Height: 4.7mm; Body Length or Diameter: 8.6mm; Actuator Length: 0.157inch; Supplier: Digikey; Supplier Part Number: 108-OS102011MA1QN1C-ND; RoHS: Yes; Category: Uncategorized; Pricing: 1200=0.39311 (USD); Mounting Technology: Through Hole; Terminal Finish: Silver; Contact Material: Brass; Insulation Material: Phenolic; Terminal Material: Brass; Min Operating Temperature: -10°C; Max Operating Temperature: 70°C; JESD-609 Code: e4; Packaging: Bulk; Switch Action: LATCHED; Switch Function: SPDT; Switch Type: Slide Switch; Termination: Solder; Actuator Type: SLIDE; Contact Function: On-On; RoHS Compliant: Yes; Reach SVHC Compliant: Yes; ComponentLink1URL: https://datasheet.ciiva.com:443/pdfs/VipMasterIC/IC/CKCI/CKCI-S-A0001796527/CKCI-S-A0001948557-1.pdf?src-supplier=IHS+Markit; ComponentLink1Description: https://datasheet.ciiva.com:443/pdfs/VipMasterIC/IC/CKCI/CKCI-S-A0001796527/CKCI-S-A0001948557-1.pdf?src-supplier=IHS+Markit; ComponentLink2URL: http://components.arrow.com/part/dataview/56747024S511465N9444?src-supplier=Arrow+Electronics; ComponentLink2Description: http://components.arrow.com/part/dataview/56747024S511465N9444?src-supplier=Arrow+Electronics; ComponentLink3URL: http://www.mouser.com/ds/2/60/os-965314.pdf?src-supplier=Mouser; ComponentLink3Description: http://www.mouser.com/ds/2/60/os-965314.pdf?src-supplier=Mouser; ComponentLink4URL: https://datasheet.octopart.com/OS102011MA1QN1C-C%26K-Components-datasheet-165712316.pdf?src-supplier=Newark; ComponentLink4Description: https://datasheet.octopart.com/OS102011MA1QN1C-C%26K-Components-datasheet-165712316.pdf?src-supplier=Newark; ComponentLink5URL: http://www.ck-components.com/14388/os_17aug.pdf/?src-supplier=Avnet; ComponentLink5Description: http://www.ck-components.com/14388/os_17aug.pdf/?src-supplier=Avnet; ComponentLink6URL: https://datasheet.octopart.com/OS102011MA1QN1C-C%26K-Components-datasheet-150821956.pdf?src-supplier=Sager+Electronics; ComponentLink6Description: https://datasheet.octopart.com/OS102011MA1QN1C-C%26K-Components-datasheet-150821956.pdf?src-supplier=Sager+Electronics
SW6 = SW Off-Mom Through: Pushbutton Switch, SPST, Momentary-tactile, 0.05A, Solder Terminal, Through Hole-straight; Manufacturer: TE Connectivity Alcoswitch; Manufacturer Part Number: FSM103; Contact Current(DC)-Max: 50mA; Operating Force-Max: 1.57N; Actuator Type: SQUARE/EXTENDED TYPE; Supplier: Digikey; Supplier Part Number: 450-1158-ND; RoHS: Yes; Category: Pushbutton Switches; Stock: 27729; Pricing: 1=0.4, 10=0.345, 25=0.3224, 100=0.2883, 400=0.25685, 800=0.2425, 1200=0.23463, 2800=0.21944, 5200=0.20947 (USD); Mounting Technology: Through Hole; Switch Action: MOMENTARY-TACTILE; Switch Function: SPST; Switch Type: Pushbutton; Termination: Solder; Contact Current(AC)-Max: 50mA; Packaging: Bulk; RoHS Compliant: Yes; Reach SVHC Compliant: Yes; ComponentLink1URL: https://www.te.com:443/usa-en/product-1437565-5.datasheet.pdf?src-supplier=IHS+Markit; ComponentLink1Description: https://www.te.com:443/usa-en/product-1437565-5.datasheet.pdf?src-supplier=IHS+Markit; ComponentLink2URL: https://datasheet.ciiva.com/2899/eng-cd-1437565-5-e2-2899955.pdf?src-supplier=Digikey; ComponentLink2Description: https://datasheet.ciiva.com/2899/eng-cd-1437565-5-e2-2899955.pdf?src-supplier=Digikey; ComponentLink3URL: https://datasheet.ciiva.com/8661/eng-cd-1437565-5-d-8661873.pdf?src-supplier=Avnet; ComponentLink3Description: https://datasheet.ciiva.com/8661/eng-cd-1437565-5-d-8661873.pdf?src-supplier=Avnet; ComponentLink4URL: https://datasheet.ciiva.com/5809/eng-cd-1437565-5-e2-5809302.pdf?src-supplier=Farnell; ComponentLink4Description: https://datasheet.ciiva.com/5809/eng-cd-1437565-5-e2-5809302.pdf?src-supplier=Farnell; ComponentLink5URL: https://datasheet.ciiva.com/7635/921681-7635435.pdf?src-supplier=Element14; ComponentLink5Description: https://datasheet.ciiva.com/7635/921681-7635435.pdf?src-supplier=Element14; ComponentLink6URL: https://datasheet.ciiva.com/31838/eng-cat-1308390-0904-e15-e25-31838910.pdf?src-supplier=Onlinecomponents.com; ComponentLink6Description: https://datasheet.ciiva.com/31838/eng-cat-1308390-0904-e15-e25-31838910.pdf?src-supplier=Onlinecomponents.com
SW7 = SW On-On-On 300mA: 12.7 x 7.5 x 4.5 mm, 2 mm Raised Slide Actuator, Right Angle, Through Hole, Slide Switch; Manufacturer: Same Sky; Manufacturer Part Number: SLW-1277545-2A-RA-S-D; Supplier: Digikey; Supplier Part Number: 2223-SLW-1277545-2A-RA-S-D-ND; RoHS: No; Stock: 2799; Pricing: 1=0.39, 10=0.336, 25=0.314, 100=0.2811, 250=0.26048, 500=0.24582, 1000=0.23217, 3000=0.2128, 5000=0.20479 (USD)
T1 = T npn 40V 0.2A: Small Signal Bipolar Transistor, 0.2A I(C), 40V V(BR)CEO, 1-Element, NPN, Silicon; Manufacturer: MCC; Package Body Material: Plastic; Max Collector Current: 200mA; DC Current Gain-Min (hFE): 30; Number of Elements: 1; Power Dissipation-Max (Abs): 350mW; Time @ Peak Reflow Temperature-Max (s): 10s; Transistor Application: AMPLIFIER; Frequency: 300MHz; Turn-off Time-Max (toff): 250ns; Turn-on Time-Max (ton): 70ns; Qualification Status: Not Qualified; Supplier: Digikey; Supplier Part Number: MMBT3904TPMSCT-ND; Manufacturer Part Number: MMBT3904-TP; RoHS: Yes; Category: BJTs; Stock: 1384347; Pricing: 1=0.1, 10=0.063, 100=0.0387, 500=0.02782, 1000=0.02427 (USD); Pins: 3; Package Shape: Rectangular; Terminal Finish: Tin; Transistor Element Material: SILICON; Max Operating Temperature: 150°C; JESD-609 Code: e3; Polarity/Channel Type: NPN; Collector-emitter Voltage-Max: 40V; JESD-30 Code: R-PDSO-G3; Moisture Sensitivity Level: 1; Package Style: SMALL OUTLINEMeter; Peak Reflow Temperature (Cel): 260°C; Surface Mount: Yes; Terminal Form: Gull Wing; Terminal Position: DUAL; Reach SVHC Compliant: Yes; RoHS Compliant: Yes; ComponentLink1URL: https://datasheet.ciiva.com:443/pdfs/VipMasterIC/IC/MCCC/MCCC-S-A0009373541/MCCC-S-A0009372855-1.pdf?src-supplier=IHS+Markit; ComponentLink1Description: https://datasheet.ciiva.com:443/pdfs/VipMasterIC/IC/MCCC/MCCC-S-A0009373541/MCCC-S-A0009372855-1.pdf?src-supplier=IHS+Markit; ComponentLink2URL: https://datasheet.ciiva.com/16291/mmbt3904sot-23-37005-16291911.pdf?src-supplier=Mouser; ComponentLink2Description: https://datasheet.ciiva.com/16291/mmbt3904sot-23-37005-16291911.pdf?src-supplier=Mouser; ComponentLink3URL: https://datasheet.ciiva.com/15139/getdatasheetpartid-251950-15139820.pdf?src-supplier=Verical; ComponentLink3Description: https://datasheet.ciiva.com/15139/getdatasheetpartid-251950-15139820.pdf?src-supplier=Verical; ComponentLink4URL: https://datasheet.ciiva.com/972/mmbt3904sot-23-972515.pdf?src-supplier=Digikey; ComponentLink4Description: https://datasheet.ciiva.com/972/mmbt3904sot-23-972515.pdf?src-supplier=Digikey; ComponentLink5URL: https://datasheet.ciiva.com/14546/70055699-14546053.pdf?src-supplier=Allied+Electronics; ComponentLink5Description: https://datasheet.ciiva.com/14546/70055699-14546053.pdf?src-supplier=Allied+Electronics; ComponentLink6URL: https://datasheet.ciiva.com/16742/mmbt3904tsot-523-16742101.pdf?src-supplier=Future+Electronics; ComponentLink6Description: https://datasheet.ciiva.com/16742/mmbt3904tsot-523-16742101.pdf?src-supplier=Future+Electronics; ComponentLink7URL: https://datasheet.ciiva.com/972/mmbt3904sot-23-972516.pdf?src-supplier=Digikey; ComponentLink7Description: https://datasheet.ciiva.com/972/mmbt3904sot-23-972516.pdf?src-supplier=Digikey
U1 = IC STM32L412CBT6: RISC Microcontroller; Mfr_Name: STMicroelectronics; RefDes: RefDes; Type: Type; Supplier: Digikey; Supplier Part Number: 497-18227-ND; Manufacturer: STMicroelectronics; Manufacturer Part Number: STM32L412CBT6; RoHS: Yes; Category: Microcontrollers; Stock: 1307; Pricing: 1=3.88, 10=2.927, 25=2.6896, 100=2.4289, 250=2.30448, 500=2.2295, 1000=2.16779, 2500=2.10264 (USD); RoHS Compliant: Yes; ComponentLink1URL: https://datasheet.ciiva.com:443/pdfs/VipMasterIC/IC/SGST/SGST-S-A0007993151/SGST-S-A0009026353-1.pdf?src-supplier=IHS+Markit; ComponentLink1Description: https://datasheet.ciiva.com:443/pdfs/VipMasterIC/IC/SGST/SGST-S-A0007993151/SGST-S-A0009026353-1.pdf?src-supplier=IHS+Markit; ComponentLink2URL: http://www.farnell.com/datasheets/2710915.pdf?src-supplier=Farnell; ComponentLink2Description: http://www.farnell.com/datasheets/2710915.pdf?src-supplier=Farnell; ComponentLink3URL: https://www.st.com/resource/en/datasheet/stm32l412kb.pdf?src-supplier=Digikey; ComponentLink3Description: https://www.st.com/resource/en/datasheet/stm32l412kb.pdf?src-supplier=Digikey; ComponentLink4URL: https://datasheet.octopart.com/STM32L412CBT6-STMicroelectronics-datasheet-136158773.pdf?src-supplier=Future+Electronics; ComponentLink4Description: https://datasheet.octopart.com/STM32L412CBT6-STMicroelectronics-datasheet-136158773.pdf?src-supplier=Future+Electronics